# EAGLE design 8x8 led matrix (EAGLE 7.5.0)
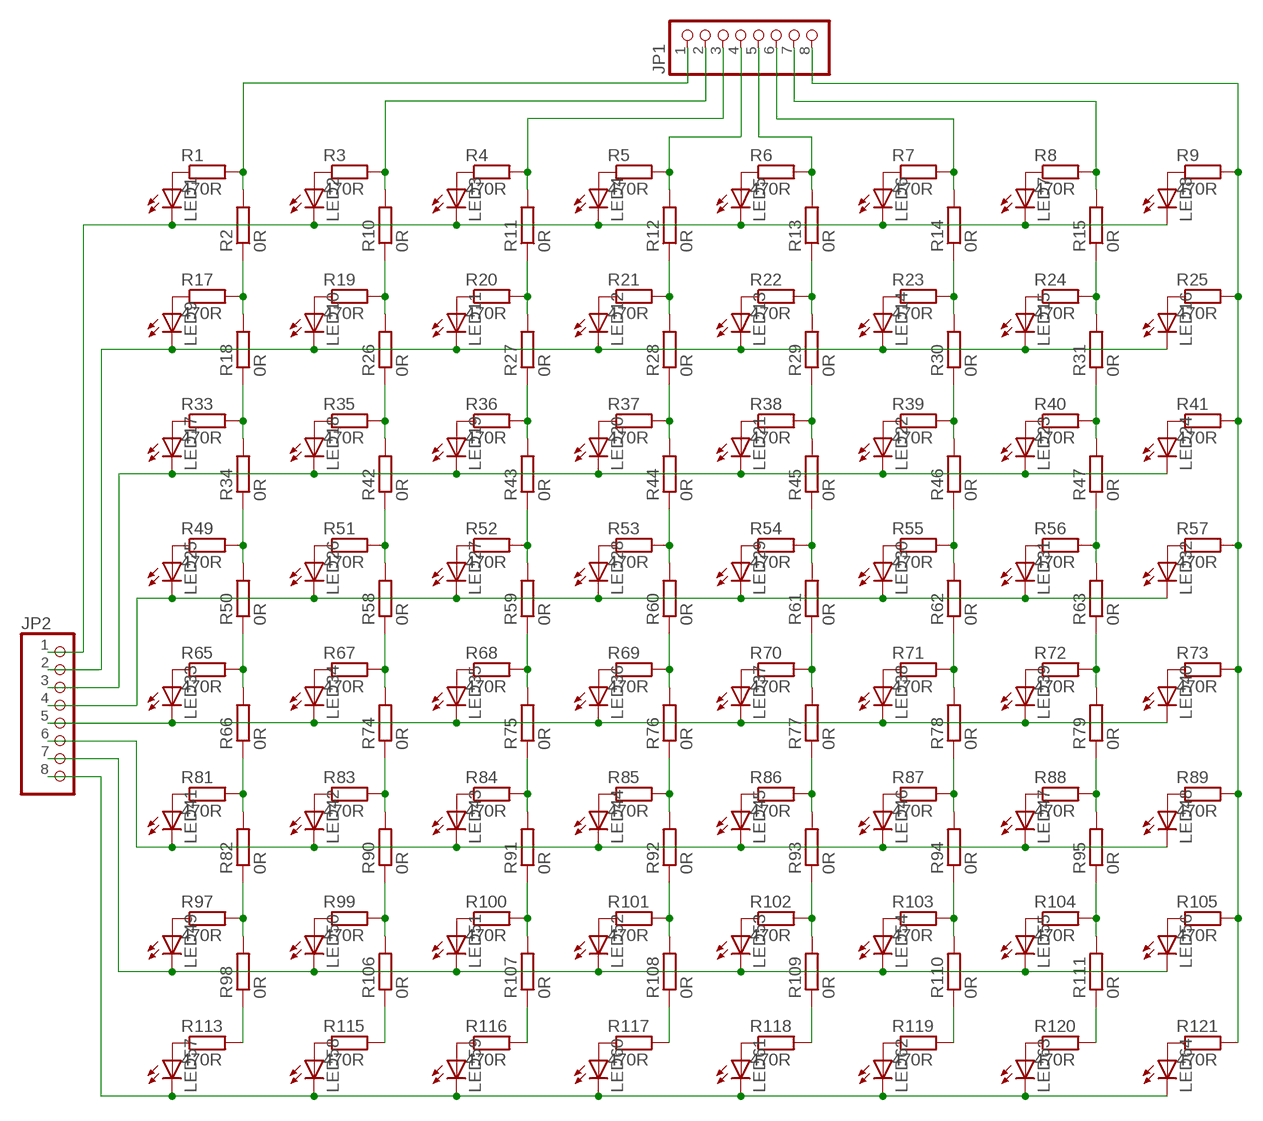
[diagram p0: schematic, sheet 1]

## Parts
JP1  PINHD-1X8  [1X08]
JP2  PINHD-1X8  [1X08]
LED1  LED5MM  [LED5MM]
LED2  LED5MM  [LED5MM]
LED3  LED5MM  [LED5MM]
LED4  LED5MM  [LED5MM]
LED5  LED5MM  [LED5MM]
LED6  LED5MM  [LED5MM]
LED7  LED5MM  [LED5MM]
LED8  LED5MM  [LED5MM]
LED9  LED5MM  [LED5MM]
LED10  LED5MM  [LED5MM]
LED11  LED5MM  [LED5MM]
LED12  LED5MM  [LED5MM]
LED13  LED5MM  [LED5MM]
LED14  LED5MM  [LED5MM]
LED15  LED5MM  [LED5MM]
LED16  LED5MM  [LED5MM]
LED17  LED5MM  [LED5MM]
LED18  LED5MM  [LED5MM]
LED19  LED5MM  [LED5MM]
LED20  LED5MM  [LED5MM]
LED21  LED5MM  [LED5MM]
LED22  LED5MM  [LED5MM]
LED23  LED5MM  [LED5MM]
LED24  LED5MM  [LED5MM]
LED25  LED5MM  [LED5MM]
LED26  LED5MM  [LED5MM]
LED27  LED5MM  [LED5MM]
LED28  LED5MM  [LED5MM]
LED29  LED5MM  [LED5MM]
LED30  LED5MM  [LED5MM]
LED31  LED5MM  [LED5MM]
LED32  LED5MM  [LED5MM]
LED33  LED5MM  [LED5MM]
LED34  LED5MM  [LED5MM]
LED35  LED5MM  [LED5MM]
LED36  LED5MM  [LED5MM]
LED37  LED5MM  [LED5MM]
LED38  LED5MM  [LED5MM]
LED39  LED5MM  [LED5MM]
LED40  LED5MM  [LED5MM]
LED41  LED5MM  [LED5MM]
LED42  LED5MM  [LED5MM]
LED43  LED5MM  [LED5MM]
LED44  LED5MM  [LED5MM]
LED45  LED5MM  [LED5MM]
LED46  LED5MM  [LED5MM]
LED47  LED5MM  [LED5MM]
LED48  LED5MM  [LED5MM]
LED49  LED5MM  [LED5MM]
LED50  LED5MM  [LED5MM]
LED51  LED5MM  [LED5MM]
LED52  LED5MM  [LED5MM]
LED53  LED5MM  [LED5MM]
LED54  LED5MM  [LED5MM]
LED55  LED5MM  [LED5MM]
LED56  LED5MM  [LED5MM]
LED57  LED5MM  [LED5MM]
LED58  LED5MM  [LED5MM]
LED59  LED5MM  [LED5MM]
LED60  LED5MM  [LED5MM]
LED61  LED5MM  [LED5MM]
LED62  LED5MM  [LED5MM]
LED63  LED5MM  [LED5MM]
LED64  LED5MM  [LED5MM]
R1  470R  R-EU_R0603  [R0603]
R2  0R  R-EU_R1206  [R1206]
R3  470R  R-EU_R0603  [R0603]
R4  470R  R-EU_R0603  [R0603]
R5  470R  R-EU_R0603  [R0603]
R6  470R  R-EU_R0603  [R0603]
R7  470R  R-EU_R0603  [R0603]
R8  470R  R-EU_R0603  [R0603]
R9  470R  R-EU_R0603  [R0603]
R10  0R  R-EU_R1206  [R1206]
R11  0R  R-EU_R1206  [R1206]
R12  0R  R-EU_R1206  [R1206]
R13  0R  R-EU_R1206  [R1206]
R14  0R  R-EU_R1206  [R1206]
R15  0R  R-EU_R1206  [R1206]
R17  470R  R-EU_R0603  [R0603]
R18  0R  R-EU_R1206  [R1206]
R19  470R  R-EU_R0603  [R0603]
R20  470R  R-EU_R0603  [R0603]
R21  470R  R-EU_R0603  [R0603]
R22  470R  R-EU_R0603  [R0603]
R23  470R  R-EU_R0603  [R0603]
R24  470R  R-EU_R0603  [R0603]
R25  470R  R-EU_R0603  [R0603]
R26  0R  R-EU_R1206  [R1206]
R27  0R  R-EU_R1206  [R1206]
R28  0R  R-EU_R1206  [R1206]
R29  0R  R-EU_R1206  [R1206]
R30  0R  R-EU_R1206  [R1206]
R31  0R  R-EU_R1206  [R1206]
R33  470R  R-EU_R0603  [R0603]
R34  0R  R-EU_R1206  [R1206]
R35  470R  R-EU_R0603  [R0603]
R36  470R  R-EU_R0603  [R0603]
R37  470R  R-EU_R0603  [R0603]
R38  470R  R-EU_R0603  [R0603]
R39  470R  R-EU_R0603  [R0603]
R40  470R  R-EU_R0603  [R0603]
R41  470R  R-EU_R0603  [R0603]
R42  0R  R-EU_R1206  [R1206]
R43  0R  R-EU_R1206  [R1206]
R44  0R  R-EU_R1206  [R1206]
R45  0R  R-EU_R1206  [R1206]
R46  0R  R-EU_R1206  [R1206]
R47  0R  R-EU_R1206  [R1206]
R49  470R  R-EU_R0603  [R0603]
R50  0R  R-EU_R1206  [R1206]
R51  470R  R-EU_R0603  [R0603]
R52  470R  R-EU_R0603  [R0603]
R53  470R  R-EU_R0603  [R0603]
R54  470R  R-EU_R0603  [R0603]
R55  470R  R-EU_R0603  [R0603]
R56  470R  R-EU_R0603  [R0603]
R57  470R  R-EU_R0603  [R0603]
R58  0R  R-EU_R1206  [R1206]
R59  0R  R-EU_R1206  [R1206]
R60  0R  R-EU_R1206  [R1206]
R61  0R  R-EU_R1206  [R1206]
R62  0R  R-EU_R1206  [R1206]
R63  0R  R-EU_R1206  [R1206]
R65  470R  R-EU_R0603  [R0603]
R66  0R  R-EU_R1206  [R1206]
R67  470R  R-EU_R0603  [R0603]
R68  470R  R-EU_R0603  [R0603]
R69  470R  R-EU_R0603  [R0603]
R70  470R  R-EU_R0603  [R0603]
R71  470R  R-EU_R0603  [R0603]
R72  470R  R-EU_R0603  [R0603]
R73  470R  R-EU_R0603  [R0603]
R74  0R  R-EU_R1206  [R1206]
R75  0R  R-EU_R1206  [R1206]
R76  0R  R-EU_R1206  [R1206]
R77  0R  R-EU_R1206  [R1206]
R78  0R  R-EU_R1206  [R1206]
R79  0R  R-EU_R1206  [R1206]
R81  470R  R-EU_R0603  [R0603]
R82  0R  R-EU_R1206  [R1206]
R83  470R  R-EU_R0603  [R0603]
R84  470R  R-EU_R0603  [R0603]
R85  470R  R-EU_R0603  [R0603]
R86  470R  R-EU_R0603  [R0603]
R87  470R  R-EU_R0603  [R0603]
R88  470R  R-EU_R0603  [R0603]
R89  470R  R-EU_R0603  [R0603]
R90  0R  R-EU_R1206  [R1206]
R91  0R  R-EU_R1206  [R1206]
R92  0R  R-EU_R1206  [R1206]
R93  0R  R-EU_R1206  [R1206]
R94  0R  R-EU_R1206  [R1206]
R95  0R  R-EU_R1206  [R1206]
R97  470R  R-EU_R0603  [R0603]
R98  0R  R-EU_R1206  [R1206]
R99  470R  R-EU_R0603  [R0603]
R100  470R  R-EU_R0603  [R0603]
R101  470R  R-EU_R0603  [R0603]
R102  470R  R-EU_R0603  [R0603]
R103  470R  R-EU_R0603  [R0603]
R104  470R  R-EU_R0603  [R0603]
R105  470R  R-EU_R0603  [R0603]
R106  0R  R-EU_R1206  [R1206]
R107  0R  R-EU_R1206  [R1206]
R108  0R  R-EU_R1206  [R1206]
R109  0R  R-EU_R1206  [R1206]
R110  0R  R-EU_R1206  [R1206]
R111  0R  R-EU_R1206  [R1206]
R113  470R  R-EU_R0603  [R0603]
R115  470R  R-EU_R0603  [R0603]
R116  470R  R-EU_R0603  [R0603]
R117  470R  R-EU_R0603  [R0603]
R118  470R  R-EU_R0603  [R0603]
R119  470R  R-EU_R0603  [R0603]
R120  470R  R-EU_R0603  [R0603]
R121  470R  R-EU_R0603  [R0603]

## Nets
N$1: LED1.A R1.1
N$2: LED2.A R3.1
N$3: LED3.A R4.1
N$4: LED4.A R5.1
N$5: LED5.A R6.1
N$6: LED6.A R7.1
N$7: LED7.A R8.1
N$8: LED8.A R9.1
N$12: JP1.4 R5.2 R12.2
N$14: JP1.5 R6.2 R13.2
N$17: JP1.1 R1.2 R2.2
N$19: JP1.2 R3.2 R10.2
N$21: JP1.3 R4.2 R11.2
N$28: JP1.6 R7.2 R14.2
N$30: JP1.7 R8.2 R15.2
N$33: JP2.1 LED1.K(C) LED2.K(C) LED3.K(C) LED4.K(C) LED5.K(C) LED6.K(C) LED7.K(C) LED8.K(C)
N$34: LED9.A R17.1
N$35: LED10.A R19.1
N$36: LED11.A R20.1
N$37: LED12.A R21.1
N$38: LED13.A R22.1
N$39: LED14.A R23.1
N$40: LED15.A R24.1
N$41: LED16.A R25.1
N$42: R2.1 R17.2 R18.2
N$43: R10.1 R19.2 R26.2
N$44: R11.1 R20.2 R27.2
N$45: R12.1 R21.2 R28.2
N$46: R13.1 R22.2 R29.2
N$47: R14.1 R23.2 R30.2
N$48: R15.1 R24.2 R31.2
N$50: JP2.2 LED9.K(C) LED10.K(C) LED11.K(C) LED12.K(C) LED13.K(C) LED14.K(C) LED15.K(C) LED16.K(C)
N$51: LED17.A R33.1
N$52: LED18.A R35.1
N$53: LED19.A R36.1
N$54: LED20.A R37.1
N$55: LED21.A R38.1
N$56: LED22.A R39.1
N$57: LED23.A R40.1
N$58: LED24.A R41.1
N$59: R18.1 R33.2 R34.2
N$60: R26.1 R35.2 R42.2
N$61: R27.1 R36.2 R43.2
N$62: R28.1 R37.2 R44.2
N$63: R29.1 R38.2 R45.2
N$64: R30.1 R39.2 R46.2
N$65: R31.1 R40.2 R47.2
N$67: JP2.3 LED17.K(C) LED18.K(C) LED19.K(C) LED20.K(C) LED21.K(C) LED22.K(C) LED23.K(C) LED24.K(C)
N$68: LED25.A R49.1
N$69: LED26.A R51.1
N$70: LED27.A R52.1
N$71: LED28.A R53.1
N$72: LED29.A R54.1
N$73: LED30.A R55.1
N$74: LED31.A R56.1
N$75: LED32.A R57.1
N$76: R34.1 R49.2 R50.2
N$77: R42.1 R51.2 R58.2
N$78: R43.1 R52.2 R59.2
N$79: R44.1 R53.2 R60.2
N$80: R45.1 R54.2 R61.2
N$81: R46.1 R55.2 R62.2
N$82: R47.1 R56.2 R63.2
N$84: JP2.4 LED25.K(C) LED26.K(C) LED27.K(C) LED28.K(C) LED29.K(C) LED30.K(C) LED31.K(C) LED32.K(C)
N$85: LED33.A R65.1
N$86: LED34.A R67.1
N$87: LED35.A R68.1
N$88: LED36.A R69.1
N$89: LED37.A R70.1
N$90: LED38.A R71.1
N$91: LED39.A R72.1
N$92: LED40.A R73.1
N$93: R50.1 R65.2 R66.2
N$94: R58.1 R67.2 R74.2
N$95: R59.1 R68.2 R75.2
N$96: R60.1 R69.2 R76.2
N$97: R61.1 R70.2 R77.2
N$98: R62.1 R71.2 R78.2
N$99: R63.1 R72.2 R79.2
N$101: JP2.5 LED33.K(C) LED34.K(C) LED35.K(C) LED36.K(C) LED37.K(C) LED38.K(C) LED39.K(C) LED40.K(C)
N$102: LED41.A R81.1
N$103: LED42.A R83.1
N$104: LED43.A R84.1
N$105: LED44.A R85.1
N$106: LED45.A R86.1
N$107: LED46.A R87.1
N$108: LED47.A R88.1
N$109: LED48.A R89.1
N$110: R66.1 R81.2 R82.2
N$111: R74.1 R83.2 R90.2
N$112: R75.1 R84.2 R91.2
N$113: R76.1 R85.2 R92.2
N$114: R77.1 R86.2 R93.2
N$115: R78.1 R87.2 R94.2
N$116: R79.1 R88.2 R95.2
N$118: JP2.6 LED41.K(C) LED42.K(C) LED43.K(C) LED44.K(C) LED45.K(C) LED46.K(C) LED47.K(C) LED48.K(C)
N$119: LED49.A R97.1
N$120: LED50.A R99.1
N$121: LED51.A R100.1
N$122: LED52.A R101.1
N$123: LED53.A R102.1
N$124: LED54.A R103.1
N$125: LED55.A R104.1
N$126: LED56.A R105.1
N$127: R82.1 R97.2 R98.2
N$128: R90.1 R99.2 R106.2
N$129: R91.1 R100.2 R107.2
N$130: R92.1 R101.2 R108.2
N$131: R93.1 R102.2 R109.2
N$132: R94.1 R103.2 R110.2
N$133: R95.1 R104.2 R111.2
N$134: JP1.8 R9.2 R25.2 R41.2 R57.2 R73.2 R89.2 R105.2 R121.2
N$135: JP2.7 LED49.K(C) LED50.K(C) LED51.K(C) LED52.K(C) LED53.K(C) LED54.K(C) LED55.K(C) LED56.K(C)
N$136: LED57.A R113.1
N$137: LED58.A R115.1
N$138: LED59.A R116.1
N$139: LED60.A R117.1
N$140: LED61.A R118.1
N$141: LED62.A R119.1
N$142: LED63.A R120.1
N$143: LED64.A R121.1
N$144: R98.1 R113.2
N$145: R106.1 R115.2
N$146: R107.1 R116.2
N$147: R108.1 R117.2
N$148: R109.1 R118.2
N$149: R110.1 R119.2
N$150: R111.1 R120.2
N$152: JP2.8 LED57.K(C) LED58.K(C) LED59.K(C) LED60.K(C) LED61.K(C) LED62.K(C) LED63.K(C) LED64.K(C)

## Library data of the parts
JP1 JP2 = pinhead:PINHD-1X8: PIN HEADER
LED1-LED64 = led:LED: LED OSRAM: - CHIPLED LG R971, LG N971, LY N971, LG Q971, LY Q971, LO R971, LY R971 LH N974, LH R974 LS Q976, LO Q976, LY Q976 LO Q996 - Hyper CHIPLED LW Q18S LB Q993, LB Q99A, LB R99A - SideLED LS A670, LO A670, LY A670, LG A670, LP A670 LB A673, LV A673, LT A673, LW A673 LH A674 LY A675 LS A676, LA A676, LO A676, LY A676, LW A676 LS A679, LY A679, LG A679 - Hyper Micro SIDELED® LS Y876, LA Y876, LO Y876, LY Y876 LT Y87S - SmartLED LW L88C, LW L88S LB L89C, LB L89S, LG L890 LS L89K, LO L89K, LY L89K LS L896, LA L896, LO L896, LY L896 - TOPLED LS T670, LO T670, LY T670, LG T670, LP T670 LSG T670, LSP T670, LSY T670, LOP T670, LYG T670 LG T671, LOG T671, LSG T671 LB T673, LV T673, LT T673, LW T673 LH T674 LS T676, LA T676, LO T676, LY T676, LB T676, LH T676, LSB T676, LW T676 LB T67C, LV T67C, LT T67C, LS T67K, LO T67K, LY T67K, LW E67C LS E67B, LA E67B, LO E67B, LY E67B, LB E67C, LV E67C, LT E67C LW T67C LS T679, LY T679, LG T679 LS T770, LO T770, LY T770, LG T770, LP T770 LB T773, LV T773, LT T773, LW T773 LH T774 LS E675, LA E675, LY E675, LS T675 LS T776, LA T776, LO T776, LY T776, LB T776 LHGB T686 LT T68C, LB T68C - Hyper Mini TOPLED® LB M676 - Mini TOPLED Santana® LG M470 LS M47K, LO M47K, LY M47K Source: http://www.osram.convergy.de LUXEON: - LUMILED® LXK2-PW12-R00, LXK2-PW12-S00, LXK2-PW14-U00, LXK2-PW14-V00 LXK2-PM12-R00, LXK2-PM12-S00, LXK2-PM14-U00 LXK2-PE12-Q00, LXK2-PE12-R00, LXK2-PE12-S00, LXK2-PE14-T00, LXK2-PE14-U00 LXK2-PB12-K00, LXK2-PB12-L00, LXK2-PB12-M00, LXK2-PB14-N00, LXK2-PB14-P00, LXK2-PB14-Q00 LXK2-PR12-L00, LXK2-PR12-M00, LXK2-PR14-Q00, LXK2-PR14-R00 LXK2-PD12-Q00, LXK2-PD12-R00, LXK2-PD12-S00 LXK2-PH12-R00, LXK2-PH12-S00 LXK2-PL12-P00, LXK2-PL12-Q00, LXK2-PL12-R00 Source: www.luxeon.com KINGBRIGHT: KA-3528ASYC Source: www.kingbright.com
R1-R15 R17-R31 R33-R47 R49-R63 R65-R79 R81-R95 R97-R111 R113 R115-R121 = resistor:R-EU_: RESISTOR, European symbol

## Board
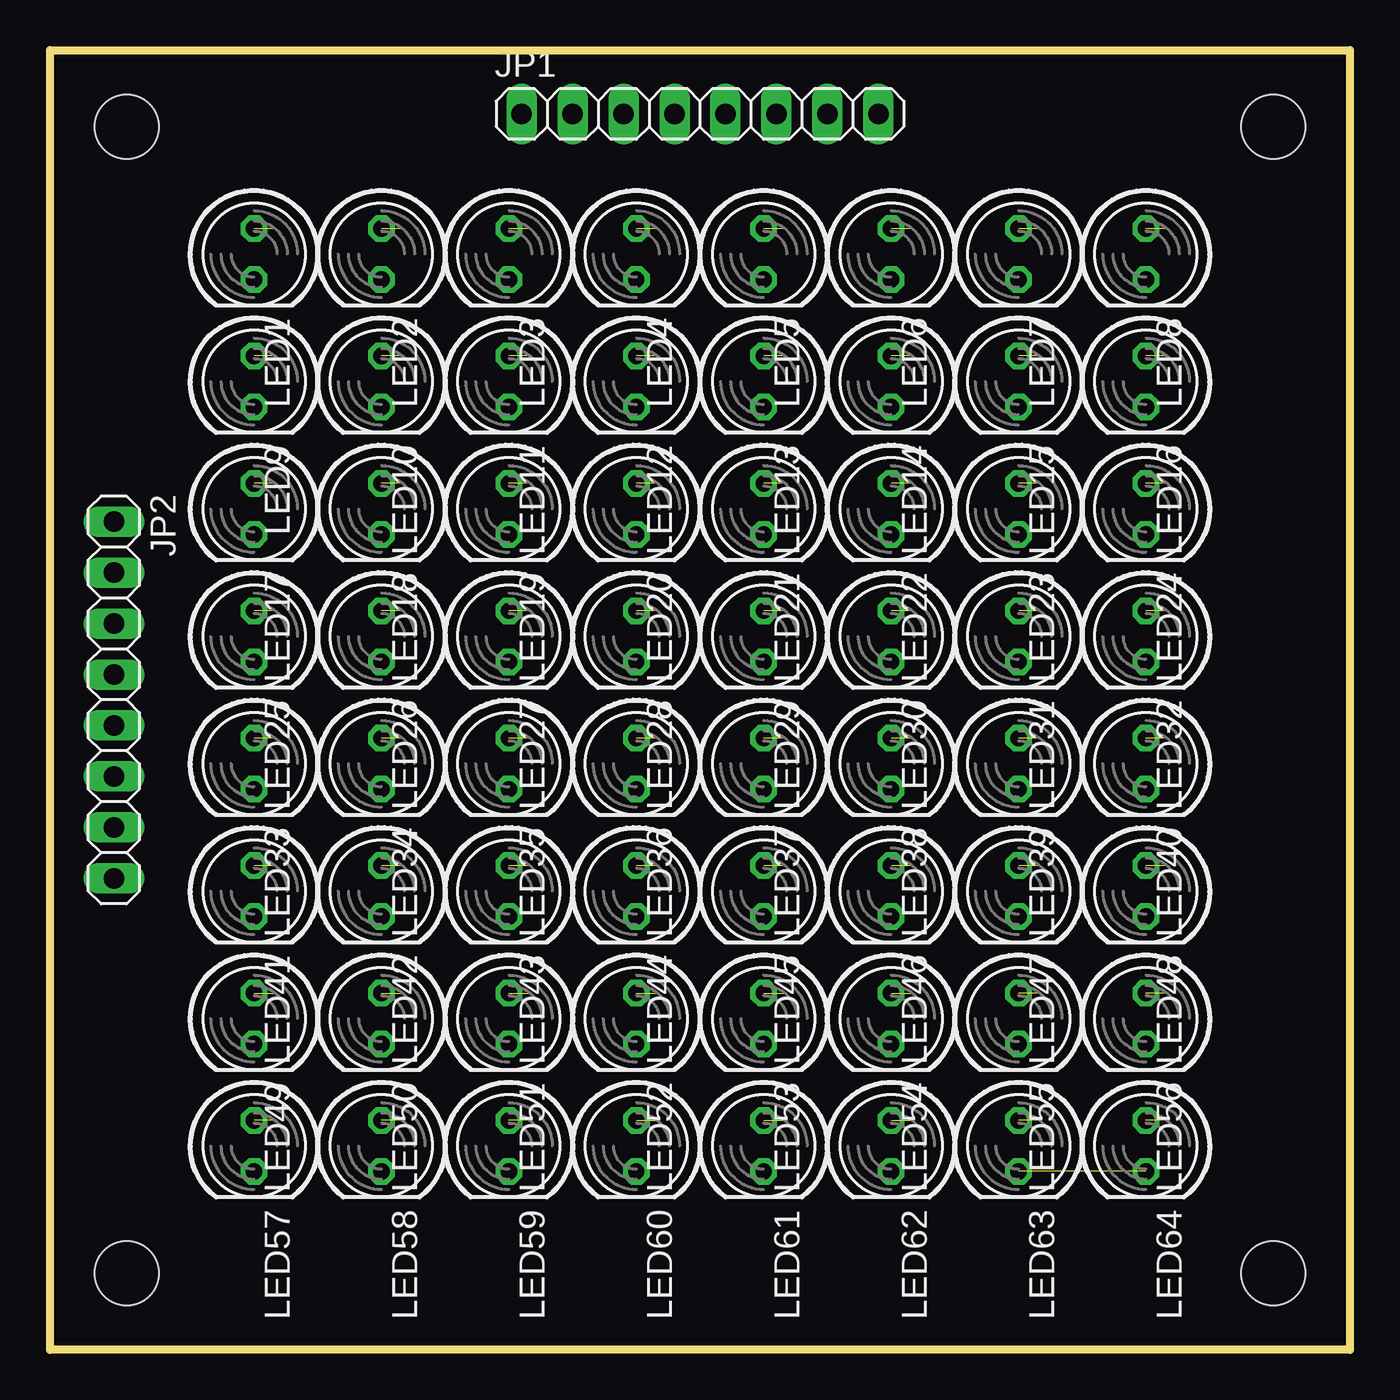
[diagram p1: board, top side]
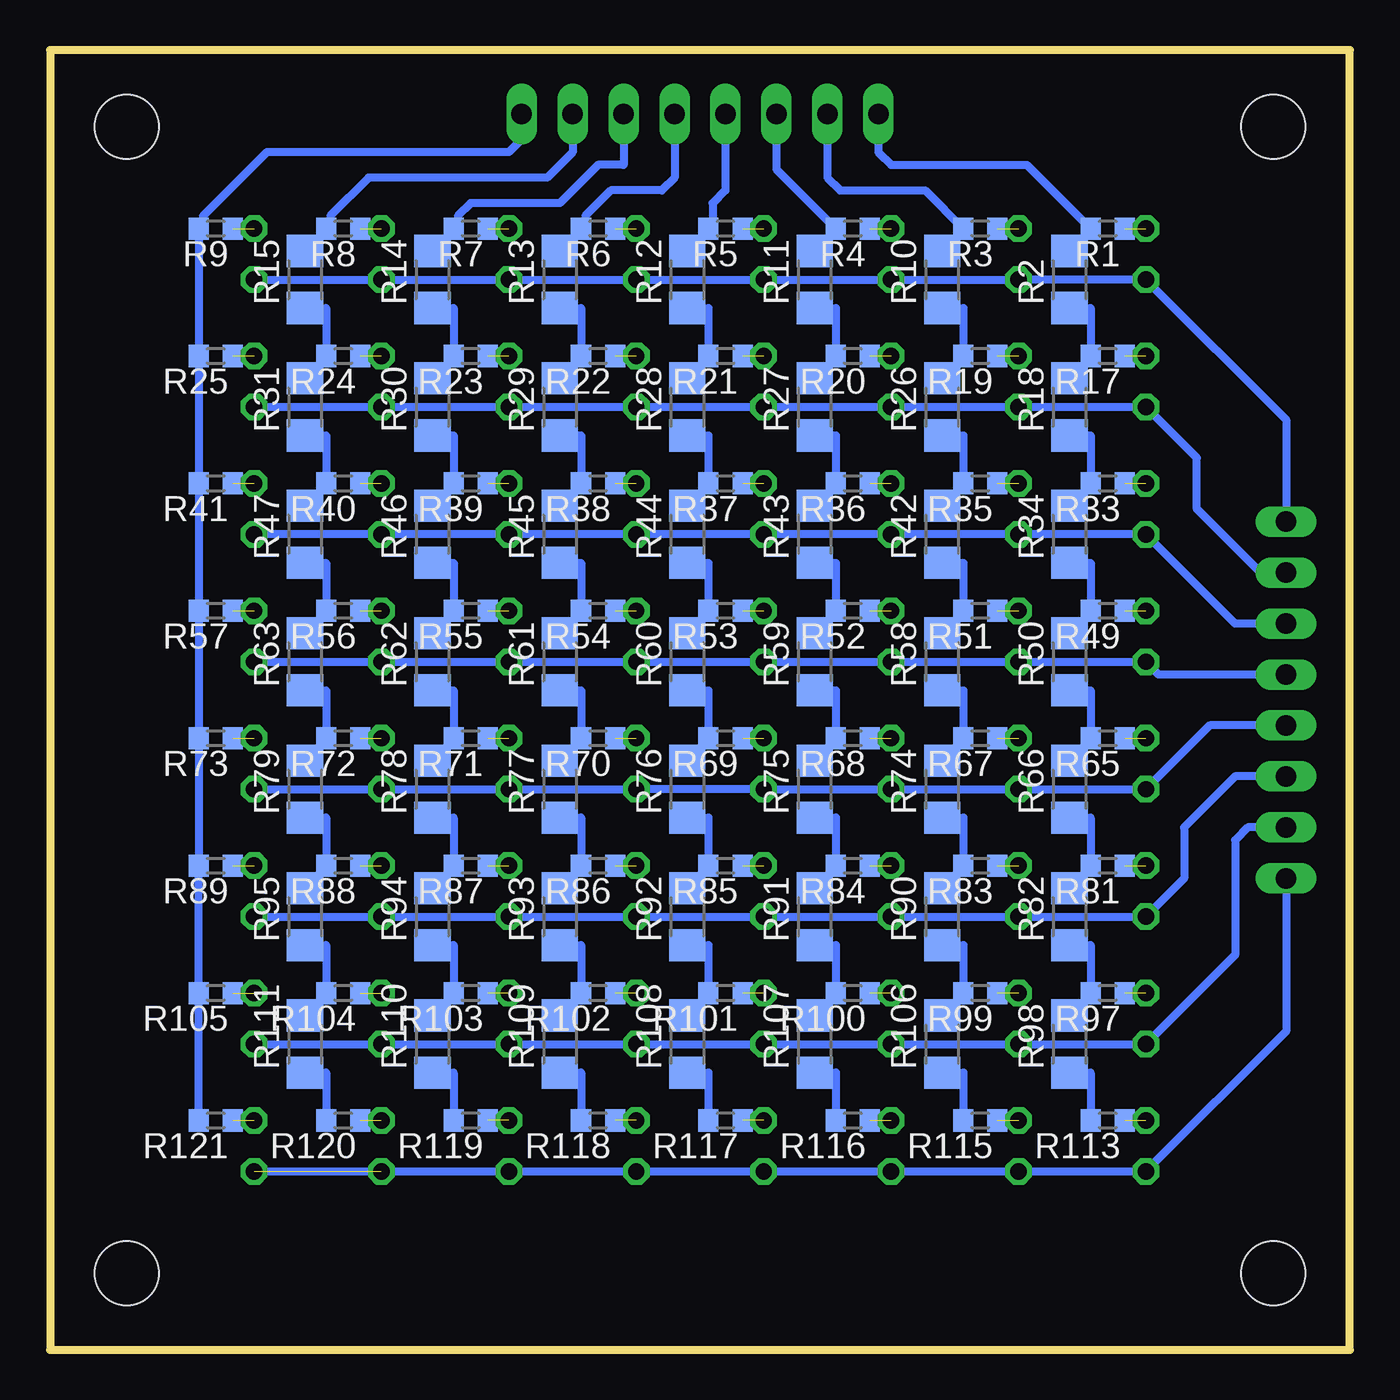
[diagram p2: board, bottom side, seen from below]

Size 64.77 x 64.77 mm. Coordinates in mm from the lower left corner, seen from the top.
Outline: 64.77,0 0,0 0,64.77 64.77,64.77 64.77,0
Copper layers (1*16): Top 0.035mm / dielectric 1.5mm / Bottom 0.035mm
Design rules "default": minimum track width 10mil, minimum drill 24mil, track to track 8mil, track to pad 8mil, pad to pad 8mil, via to via 8mil, smd to smd 8mil, copper to edge 40mil, drill to drill 8mil, minimum pad ring 10mil, minimum via ring 8mil, stop-mask expansion 4mil, vias tented up to drill 0mil, thermal gap 10mil
Holes 3.2 mm at -15.24,7.62 3.81,3.81 60.96,3.81 3.81,60.96 60.96,60.96

### Footprints (pad centres in the part's own frame; a part is rotated, then mirrored left to right if it is on the bottom)
1X08 = drill 1.016 long: 1 -8.89,0; 2 -6.35,0; 3 -3.81,0; 4 -1.27,0; 5 1.27,0; 6 3.81,0; 7 6.35,0; 8 8.89,0
LED5MM = drill 0.813 octagon: A -1.27,0; K 1.27,0
R0603 = smd 1 x 1.1: 1 -0.85,0; 2 0.85,0
R1206 = smd 1.6 x 1.803: 1 -1.422,0; 2 1.422,0

### Placement (x,y rotation side)
JP1  32.38,61.6 0 top
JP2  3.17,32.38 270 top
LED1  10.16,54.61 270 top
LED2  16.51,54.61 270 top
LED3  22.86,54.61 270 top
LED4  29.21,54.61 270 top
LED5  35.56,54.61 270 top
LED6  41.91,54.61 270 top
LED7  48.26,54.61 270 top
LED8  54.61,54.61 270 top
LED9  10.16,48.26 270 top
LED10  16.51,48.26 270 top
LED11  22.86,48.26 270 top
LED12  29.21,48.26 270 top
LED13  35.56,48.26 270 top
LED14  41.91,48.26 270 top
LED15  48.26,48.26 270 top
LED16  54.61,48.26 270 top
LED17  10.16,41.91 270 top
LED18  16.51,41.91 270 top
LED19  22.86,41.91 270 top
LED20  29.21,41.91 270 top
LED21  35.56,41.91 270 top
LED22  41.91,41.91 270 top
LED23  48.26,41.91 270 top
LED24  54.61,41.91 270 top
LED25  10.16,35.56 270 top
LED26  16.51,35.56 270 top
LED27  22.86,35.56 270 top
LED28  29.21,35.56 270 top
LED29  35.56,35.56 270 top
LED30  41.91,35.56 270 top
LED31  48.26,35.56 270 top
LED32  54.61,35.56 270 top
LED33  10.16,29.21 270 top
LED34  16.51,29.21 270 top
LED35  22.86,29.21 270 top
LED36  29.21,29.21 270 top
LED37  35.56,29.21 270 top
LED38  41.91,29.21 270 top
LED39  48.26,29.21 270 top
LED40  54.61,29.21 270 top
LED41  10.16,22.86 270 top
LED42  16.51,22.86 270 top
LED43  22.86,22.86 270 top
LED44  29.21,22.86 270 top
LED45  35.56,22.86 270 top
LED46  41.91,22.86 270 top
LED47  48.26,22.86 270 top
LED48  54.61,22.86 270 top
LED49  10.16,16.51 270 top
LED50  16.51,16.51 270 top
LED51  22.86,16.51 270 top
LED52  29.21,16.51 270 top
LED53  35.56,16.51 270 top
LED54  41.91,16.51 270 top
LED55  48.26,16.51 270 top
LED56  54.61,16.51 270 top
LED57  10.16,10.16 270 top
LED58  16.51,10.16 270 top
LED59  22.86,10.16 270 top
LED60  29.21,10.16 270 top
LED61  35.56,10.16 270 top
LED62  41.91,10.16 270 top
LED63  48.26,10.16 270 top
LED64  54.61,10.16 270 top
R1  12.06,55.88 180 bottom
R2  13.97,53.34 90 bottom
R3  18.41,55.88 180 bottom
R4  24.77,55.88 180 bottom
R5  31.12,55.88 180 bottom
R6  37.47,55.88 180 bottom
R7  43.81,55.88 180 bottom
R8  50.17,55.88 180 bottom
R9  56.52,55.88 180 bottom
R10  20.32,53.34 90 bottom
R11  26.67,53.34 90 bottom
R12  33.02,53.34 90 bottom
R13  39.37,53.34 90 bottom
R14  45.72,53.34 90 bottom
R15  52.07,53.34 90 bottom
R17  12.06,49.53 180 bottom
R18  13.97,46.99 90 bottom
R19  18.41,49.53 180 bottom
R20  24.77,49.53 180 bottom
R21  31.12,49.53 180 bottom
R22  37.47,49.53 180 bottom
R23  43.81,49.53 180 bottom
R24  50.17,49.53 180 bottom
R25  56.52,49.53 180 bottom
R26  20.32,46.99 90 bottom
R27  26.67,46.99 90 bottom
R28  33.02,46.99 90 bottom
R29  39.37,46.99 90 bottom
R30  45.72,46.99 90 bottom
R31  52.07,46.99 90 bottom
R33  12.06,43.18 180 bottom
R34  13.97,40.64 90 bottom
R35  18.41,43.18 180 bottom
R36  24.77,43.18 180 bottom
R37  31.12,43.18 180 bottom
R38  37.47,43.18 180 bottom
R39  43.81,43.18 180 bottom
R40  50.17,43.18 180 bottom
R41  56.52,43.18 180 bottom
R42  20.32,40.64 90 bottom
R43  26.67,40.64 90 bottom
R44  33.02,40.64 90 bottom
R45  39.37,40.64 90 bottom
R46  45.72,40.64 90 bottom
R47  52.07,40.64 90 bottom
R49  12.06,36.83 180 bottom
R50  13.97,34.29 90 bottom
R51  18.41,36.83 180 bottom
R52  24.77,36.83 180 bottom
R53  31.12,36.83 180 bottom
R54  37.47,36.83 180 bottom
R55  43.81,36.83 180 bottom
R56  50.17,36.83 180 bottom
R57  56.52,36.83 180 bottom
R58  20.32,34.29 90 bottom
R59  26.67,34.29 90 bottom
R60  33.02,34.29 90 bottom
R61  39.37,34.29 90 bottom
R62  45.72,34.29 90 bottom
R63  52.07,34.29 90 bottom
R65  12.06,30.48 180 bottom
R66  13.97,27.94 90 bottom
R67  18.41,30.48 180 bottom
R68  24.77,30.48 180 bottom
R69  31.12,30.48 180 bottom
R70  37.47,30.48 180 bottom
R71  43.81,30.48 180 bottom
R72  50.17,30.48 180 bottom
R73  56.52,30.48 180 bottom
R74  20.32,27.94 90 bottom
R75  26.67,27.94 90 bottom
R76  33.02,27.94 90 bottom
R77  39.37,27.94 90 bottom
R78  45.72,27.94 90 bottom
R79  52.07,27.94 90 bottom
R81  12.06,24.13 180 bottom
R82  13.97,21.59 90 bottom
R83  18.41,24.13 180 bottom
R84  24.77,24.13 180 bottom
R85  31.12,24.13 180 bottom
R86  37.47,24.13 180 bottom
R87  43.81,24.13 180 bottom
R88  50.17,24.13 180 bottom
R89  56.52,24.13 180 bottom
R90  20.32,21.59 90 bottom
R91  26.67,21.59 90 bottom
R92  33.02,21.59 90 bottom
R93  39.37,21.59 90 bottom
R94  45.72,21.59 90 bottom
R95  52.07,21.59 90 bottom
R97  12.06,17.78 180 bottom
R98  13.97,15.24 90 bottom
R99  18.41,17.78 180 bottom
R100  24.77,17.78 180 bottom
R101  31.12,17.78 180 bottom
R102  37.47,17.78 180 bottom
R103  43.81,17.78 180 bottom
R104  50.17,17.78 180 bottom
R105  56.52,17.78 180 bottom
R106  20.32,15.24 90 bottom
R107  26.67,15.24 90 bottom
R108  33.02,15.24 90 bottom
R109  39.37,15.24 90 bottom
R110  45.72,15.24 90 bottom
R111  52.07,15.24 90 bottom
R113  12.06,11.43 180 bottom
R115  18.41,11.43 180 bottom
R116  24.77,11.43 180 bottom
R117  31.12,11.43 180 bottom
R118  37.47,11.43 180 bottom
R119  43.81,11.43 180 bottom
R120  50.17,11.43 180 bottom
R121  56.52,11.43 180 bottom

### Tracks (layer width: path | path; a pad name or v marks a point on that pad's centre or on a via)
N$1  (1 unrouted)
N$2  (1 unrouted)
N$3  (1 unrouted)
N$4  (1 unrouted)
N$5  (1 unrouted)
N$6  (1 unrouted)
N$7  (1 unrouted)
N$8  (1 unrouted)
N$12
  Bottom 0.406: R12.2 31.97,55.82 R5.2 31.75,56.1 31.75,57.15 31.12,57.79 JP1.4
N$14
  Bottom 0.406: R13.2 38.31,55.82 R6.2 38.1,56.1 38.1,56.51 36.83,57.79 34.29,57.79 33.66,58.42 JP1.5
N$17
  Bottom 0.406: R2.2 12.92,55.82 R1.2 16.09,59.05 22.86,59.05 23.5,59.69 JP1.1
N$19
  Bottom 0.406: R10.2 19.27,55.82 R3.2 21.17,57.79 25.4,57.79 26.04,58.42 JP1.2
N$21
  Bottom 0.406: R11.2 25.62,55.82 R4.2 28.58,58.84 JP1.3
N$28
  Bottom 0.406: R14.2 44.66,55.82 R7.2 44.45,56.1 44.45,56.51 43.81,57.15 39.37,57.15 37.47,59.05 36.2,59.05 JP1.6
N$30
  Bottom 0.406: R15.2 51.02,55.82 R8.2 50.8,56.1 50.8,56.51 48.9,58.42 40.01,58.42 38.73,59.69 JP1.7
N$33
  Bottom 0.406: LED8.K LED7.K LED6.K LED5.K LED4.K LED3.K LED2.K LED1.K 3.17,46.35 JP2.1
N$34  (1 unrouted)
N$35  (1 unrouted)
N$36  (1 unrouted)
N$37  (1 unrouted)
N$38  (1 unrouted)
N$39  (1 unrouted)
N$40  (1 unrouted)
N$41  (1 unrouted)
N$42
  Bottom 0.406: R2.1 12.92,51.92 R17.2 12.92,49.47 R18.2
N$43
  Bottom 0.406: R10.1 19.27,51.92 R19.2 19.27,49.47 R26.2
N$44
  Bottom 0.406: R11.1 25.62,51.92 R20.2 25.62,49.47 R27.2
N$45
  Bottom 0.406: R12.1 31.97,51.92 R21.2 31.97,49.47 R28.2
N$46
  Bottom 0.406: R13.1 38.31,51.92 R22.2 38.31,49.47 R29.2
N$47
  Bottom 0.406: R14.1 44.66,51.92 R23.2 44.66,49.47 R30.2
N$48
  Bottom 0.406: R15.1 51.02,51.92 R24.2 51.02,49.47 R31.2
N$50
  Bottom 0.406: LED16.K LED15.K LED14.K LED13.K LED12.K LED11.K LED10.K LED9.K 7.62,44.45 7.62,41.91 4.44,38.73 JP2.2
N$51  (1 unrouted)
N$52  (1 unrouted)
N$53  (1 unrouted)
N$54  (1 unrouted)
N$55  (1 unrouted)
N$56  (1 unrouted)
N$57  (1 unrouted)
N$58  (1 unrouted)
N$59
  Bottom 0.406: R18.1 12.92,45.57 R33.2 12.92,43.12 R34.2
N$60
  Bottom 0.406: R26.1 19.27,45.57 R35.2 19.27,43.12 R42.2
N$61
  Bottom 0.406: R27.1 25.62,45.57 R36.2 25.62,43.12 R43.2
N$62
  Bottom 0.406: R28.1 31.97,45.57 R37.2 31.97,43.12 R44.2
N$63
  Bottom 0.406: R29.1 38.31,45.57 R38.2 38.31,43.12 R45.2
N$64
  Bottom 0.406: R30.1 44.66,45.57 R39.2 44.66,43.12 R46.2
N$65
  Bottom 0.406: R31.1 51.02,45.57 R40.2 51.02,43.12 R47.2
N$67
  Bottom 0.406: LED24.K LED23.K LED22.K LED21.K LED20.K LED19.K LED18.K LED17.K 5.71,36.2 JP2.3
N$68  (1 unrouted)
N$69  (1 unrouted)
N$70  (1 unrouted)
N$71  (1 unrouted)
N$72  (1 unrouted)
N$73  (1 unrouted)
N$74  (1 unrouted)
N$75  (1 unrouted)
N$76
  Bottom 0.406: R34.1 12.92,39.22 R49.2 12.92,36.77 R50.2
N$77
  Bottom 0.406: R42.1 19.27,39.22 R51.2 19.27,36.77 R58.2
N$78
  Bottom 0.406: R43.1 25.62,39.22 R52.2 25.62,36.77 R59.2
N$79
  Bottom 0.406: R44.1 31.97,39.22 R53.2 31.97,36.77 R60.2
N$80
  Bottom 0.406: R45.1 38.31,39.22 R54.2 38.31,36.77 R61.2
N$81
  Bottom 0.406: R46.1 44.66,39.22 R55.2 44.66,36.77 R62.2
N$82
  Bottom 0.406: R47.1 51.02,39.22 R56.2 51.02,36.77 R63.2
N$84
  Bottom 0.406: LED32.K LED31.K LED30.K LED29.K LED28.K LED27.K LED26.K LED25.K 9.53,33.66 JP2.4
N$85  (1 unrouted)
N$86  (1 unrouted)
N$87  (1 unrouted)
N$88  (1 unrouted)
N$89  (1 unrouted)
N$90  (1 unrouted)
N$91  (1 unrouted)
N$92  (1 unrouted)
N$93
  Bottom 0.406: R50.1 12.92,32.87 R65.2 12.92,30.42 R66.2
N$94
  Bottom 0.406: R58.1 19.27,32.87 R67.2 19.27,30.42 R74.2
N$95
  Bottom 0.406: R59.1 25.62,32.87 R68.2 25.62,30.42 R75.2
N$96
  Bottom 0.406: R60.1 31.97,32.87 R69.2 31.97,30.42 R76.2
N$97
  Bottom 0.406: R61.1 38.31,32.87 R70.2 38.31,30.42 R77.2
N$98
  Bottom 0.406: R62.1 44.66,32.87 R71.2 44.66,30.42 R78.2
N$99
  Bottom 0.406: R63.1 51.02,32.87 R72.2 51.02,30.42 R79.2
N$101
  Bottom 0.406: LED40.K LED39.K LED38.K LED37.K LED36.K LED35.K LED34.K LED33.K 6.98,31.12 JP2.5
N$102  (1 unrouted)
N$103  (1 unrouted)
N$104  (1 unrouted)
N$105  (1 unrouted)
N$106  (1 unrouted)
N$107  (1 unrouted)
N$108  (1 unrouted)
N$109  (1 unrouted)
N$110
  Bottom 0.406: R66.1 12.92,26.52 R81.2 12.92,24.07 R82.2
N$111
  Bottom 0.406: R74.1 19.27,26.52 R83.2 19.27,24.07 R90.2
N$112
  Bottom 0.406: R75.1 25.62,26.52 R84.2 25.62,24.07 R91.2
N$113
  Bottom 0.406: R76.1 31.97,26.52 R85.2 31.97,24.07 R92.2
N$114
  Bottom 0.406: R77.1 38.31,26.52 R86.2 38.31,24.07 R93.2
N$115
  Bottom 0.406: R78.1 44.66,26.52 R87.2 44.66,24.07 R94.2
N$116
  Bottom 0.406: R79.1 51.02,26.52 R88.2 51.02,24.07 R95.2
N$118
  Bottom 0.406: LED48.K LED47.K LED46.K LED45.K LED44.K LED43.K LED42.K LED41.K 8.26,23.49 8.26,26.04 5.71,28.58 JP2.6
N$119  (1 unrouted)
N$120  (1 unrouted)
N$121  (1 unrouted)
N$122  (1 unrouted)
N$123  (1 unrouted)
N$124  (1 unrouted)
N$125  (1 unrouted)
N$126  (1 unrouted)
N$127
  Bottom 0.406: R82.1 12.92,20.17 R97.2 12.92,17.72 R98.2
N$128
  Bottom 0.406: R90.1 19.27,20.17 R99.2 19.27,17.72 R106.2
N$129
  Bottom 0.406: R91.1 25.62,20.17 R100.2 25.62,17.72 R107.2
N$130
  Bottom 0.406: R92.1 31.97,20.17 R101.2 31.97,17.72 R108.2
N$131
  Bottom 0.406: R93.1 38.31,20.17 R102.2 38.31,17.72 R109.2
N$132
  Bottom 0.406: R94.1 44.66,20.17 R103.2 44.66,17.72 R110.2
N$133
  Bottom 0.406: R95.1 51.02,20.17 R104.2 51.02,17.72 R111.2
N$134
  Bottom 0.406: R121.2 R105.2 R89.2 R73.2 R57.2 R41.2 R25.2 R9.2 57.15,56.1 57.15,56.51 53.97,59.69 41.91,59.69 41.27,60.32 JP1.8
N$135
  Bottom 0.406: LED56.K LED55.K LED54.K LED53.K LED52.K LED51.K LED50.K LED49.K 5.71,19.68 5.71,25.4 5.08,26.04 JP2.7
N$136  (1 unrouted)
N$137  (1 unrouted)
N$138  (1 unrouted)
N$139  (1 unrouted)
N$140  (1 unrouted)
N$141  (1 unrouted)
N$142  (1 unrouted)
N$143  (1 unrouted)
N$144
  Bottom 0.406: R98.1 12.92,13.82 R113.2
N$145
  Bottom 0.406: R106.1 19.27,13.82 R115.2
N$146
  Bottom 0.406: R107.1 25.62,13.82 R116.2
N$147
  Bottom 0.406: R108.1 31.97,13.82 R117.2
N$148
  Bottom 0.406: R109.1 38.31,13.82 R118.2
N$149
  Bottom 0.406: R110.1 44.66,13.82 R119.2
N$150
  Bottom 0.406: R111.1 51.02,13.82 R120.2
N$152  (1 unrouted)
  Bottom 0.406: LED64.K LED62.K LED61.K LED60.K LED59.K LED58.K LED57.K 3.17,15.88 JP2.8

### Text on the board
Document: C 1-8 | R 1-8